# EasyEDA Pro project PicoMiteVGAV1.0.eprj, board PCB3
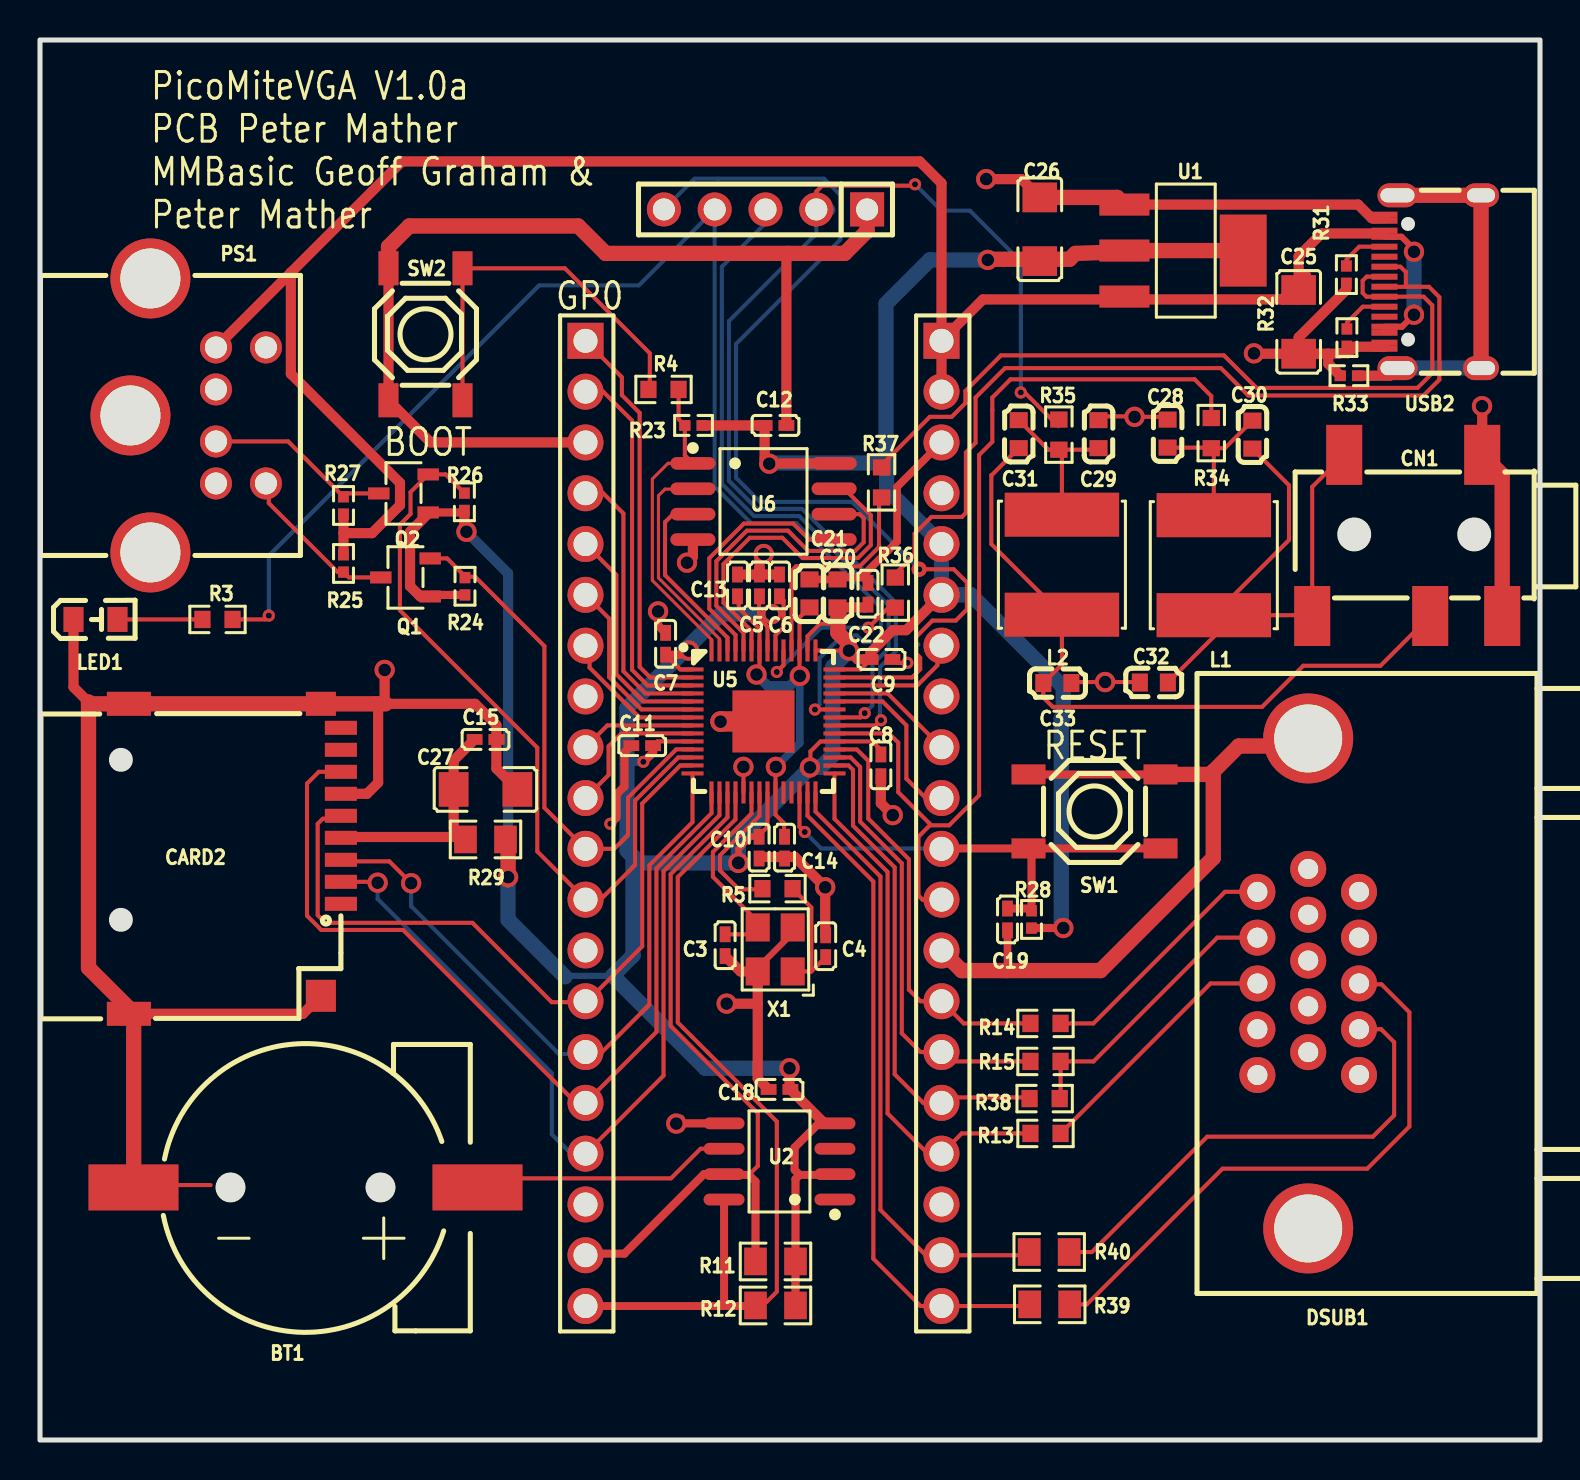
[diagram p1: board, top side]
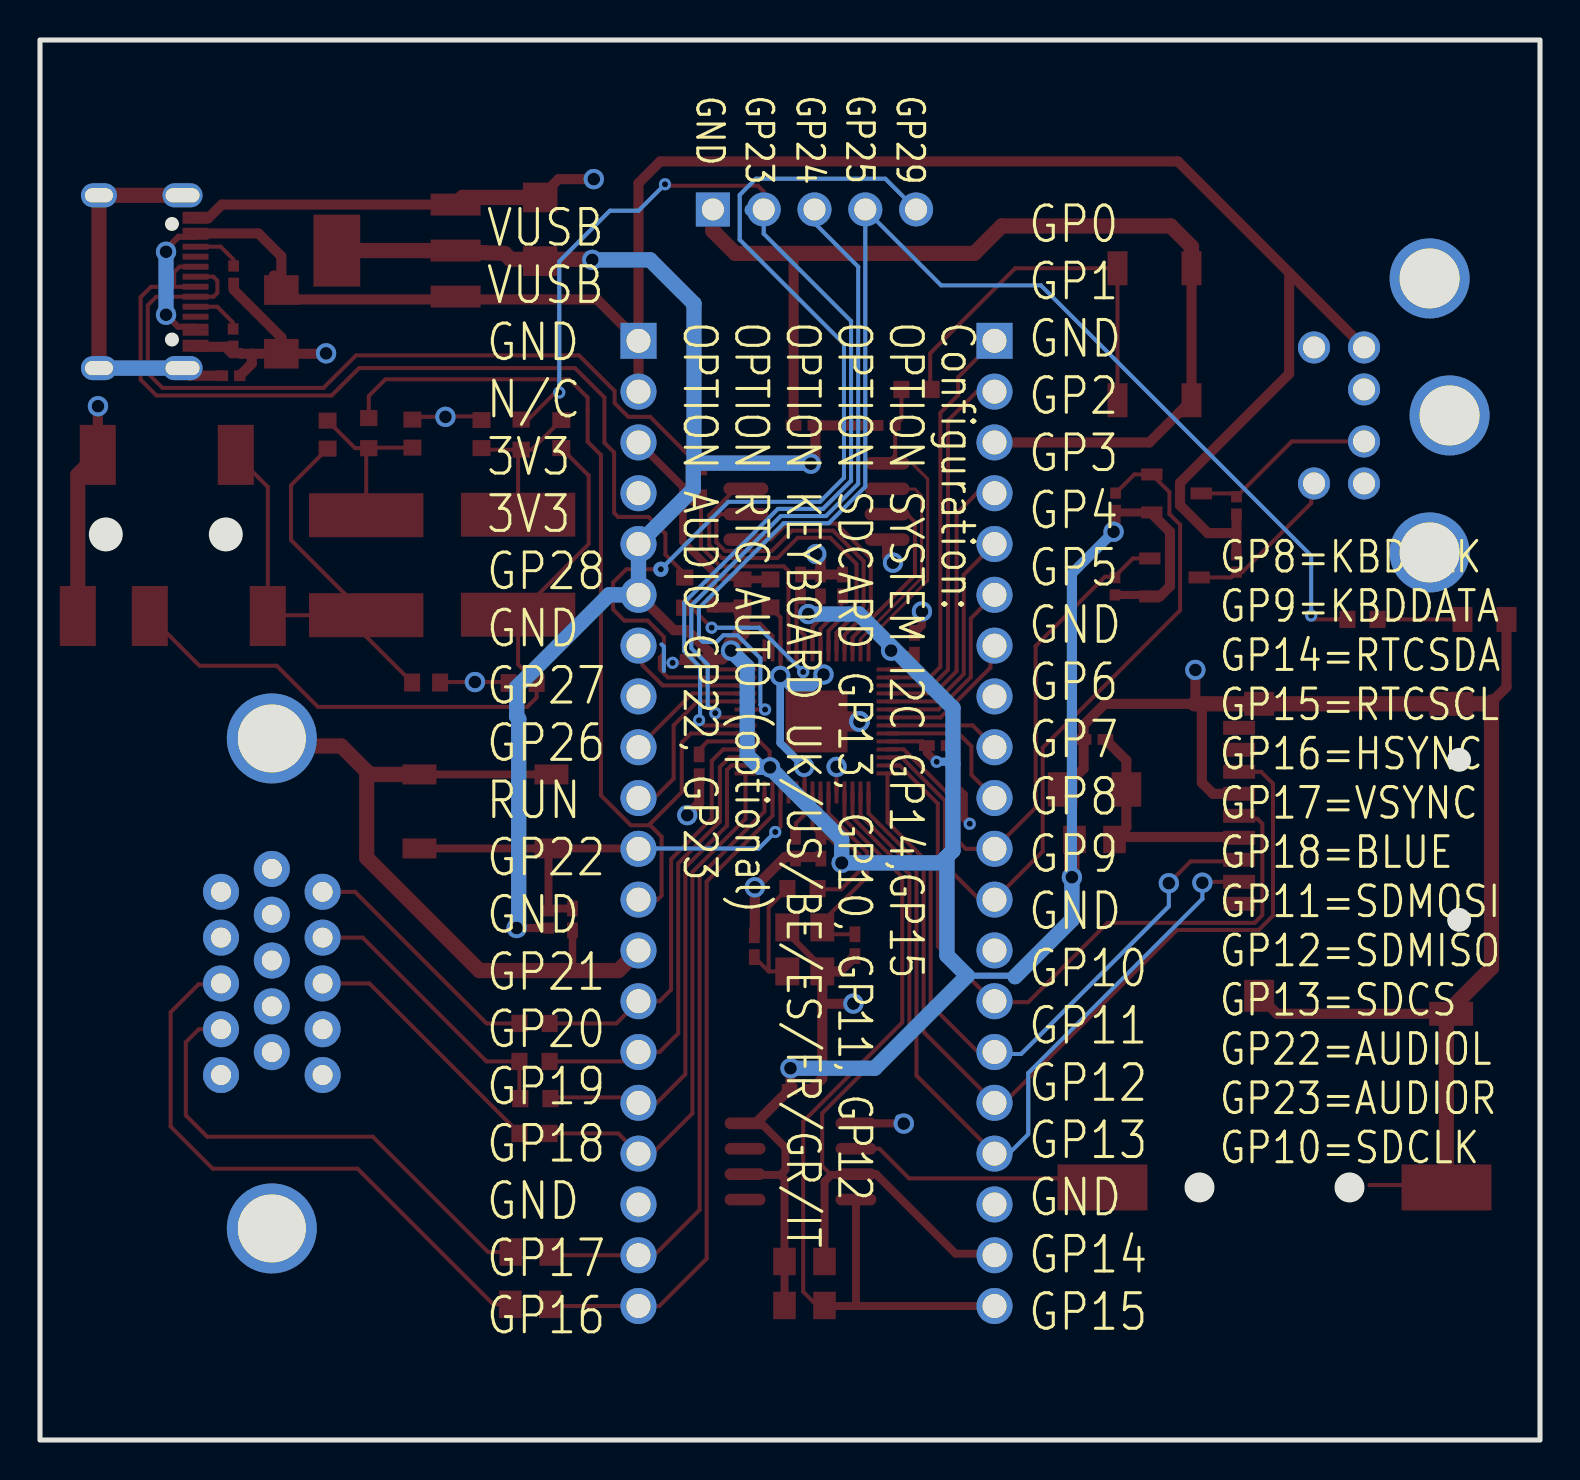
[diagram p2: board, bottom side, seen from below]

Outline 75 x 70 mm; copper layers: Top Layer, Bottom Layer. Coordinates in mm from the lower left corner of the outline.
Outline path: rectangle 75,0 0,70
Stack: Top Layer 0.035mm / Dielectric1 1.51mm FR4 er 4.5 / Bottom Layer 0.035mm

## Design rules (mm)
spacing safeClearance (default): track to track 0.152, other pairs 0.152 to 0.3
track width trackWidth (default): min 0.127, default 0.254, max 2.54
differential pair differentialPair (default): width min 0.127, default 0.254, max 2.54; gap min 0.152, default 0.152
via viaSize (default): diameter min 0.5, default 0.61, max 10; hole min 0.3, default 0.305, max 6

## Placement (name value [footprint] x y rotation side)
BT1  CR1220-2ZX  [BAT-SMD_CR1220-2ZX]  13.27 12.63 180 top
C3  30pF  [C0402]  34.26 24.74 90 top
C4  30pF  [C0402]  39.28 24.69 270 top
C5  100nF  [C0402_NEW]  35.97 42.73 270 top
C6  100nF  [C0402_NEW]  36.97 42.73 270 top
C7  100nF  [C0402_NEW]  31.28 39.81 270 top
C8  100nF  [C0402_NEW]  42.04 33.73 90 top
C9  100nF  [C0402_NEW]  42.07 39.03 180 top
C10  100nF  [C0402_NEW]  35.96 29.62 90 top
C11  100nF  [C0402_NEW]  30.11 34.72 0 top
C12  100nF  [C0402_NEW]  36.78 50.73 180 top
C13  100nF  [C0402_NEW]  34.88 42.73 90 top
C14  100nF  [C0402_NEW]  37.23 29.62 270 top
C15  100nF  [C0402_NEW]  22.28 35.03 0 top
C18  100nF  [C0402_NEW]  36.97 17.53 0 top
C19  100nF  [C0402_NEW]  48.38 26.03 90 top
C20  2.2uF  [C0603]  39.88 42.33 270 top
C21  2.2uF  [C0603]  38.47 42.33 90 top
C22  100nF  [C0402_NEW]  41.4 42.31 270 top
C25  10uF  [C1206]  62.93 55.91 90 top
C26  10uF  [C1206]  49.99 60.54 270 top
C27  10uF  [C1206]  22.28 32.53 0 top
C28  33nF  [C0603]  56.38 50.32 270 top
C29  33nF  [C0603]  52.92 50.29 270 top
C30  2.7nF  [C0603]  60.62 50.27 270 top
C31  2.7nF  [C0603]  48.94 50.29 270 top
C32  68nF  [C0603]  55.69 37.87 0 top
C33  68nF  [C0603]  50.87 37.85 180 top
CARD2  TF PUSH  [TF-SMD_TF-PUSH]  9.74 29.06 270 top
CN1  PJ-327A0-SMT  [AUDIO-SMD_PJ-327A0-SMT]  68.36 45.23 180 top
DSUB1  D-DMRH15PF-E006  [DSUB-TH_15P-P2.29-H-F_DDMRH15PFE006]  63.41 22.83 90 top
H1  PZ254V-11-05P  [HDR-TH_5P-P2.54-V-M]  36.28 61.53 180 top
J1  2.54-1*20P直针  [HDR-TH_20P-P2.54-V-M-1]  27.28 30.83 270 top
J2  2.54-1*20P直针  [HDR-TH_20P-P2.54-V-M-1]  45.07 30.83 270 top
L1  4.7mH  [IND-SMD_L6.0-W6.0]  58.69 43.74 270 top
L2  4.7mH  [IND-SMD_L6.0-W6.0]  51.1 43.77 270 top
LED1  NCD0805R1  [LED0805-RD]  2.77 41.03 0 top
PS1  DS1093-01-PN60  [CONN-TH_DS1093-01-PN60]  7.91 51.23 270 top
Q1  BSN20  [SOT-23-3_L2.9-W1.6-P1.90-LS2.8-BR]  18.28 43.13 0 top
Q2  BSN20  [SOT-23-3_L2.9-W1.6-P1.90-LS2.8-BR]  18.18 47.33 0 top
R3  1kΩ  [R0603]  8.88 41.03 180 top
R4  1kΩ  [R0603]  31.18 52.53 180 top
R5  1kΩ  [R0603]  36.88 27.57 180 top
R11  10kΩ  [R0805]  36.78 8.93 0 top
R12  10kΩ  [R0805]  36.78 6.73 0 top
R13  270Ω  [R0603]  50.28 15.33 0 top
R14  270Ω  [R0603]  50.28 20.83 0 top
R15  390Ω  [R0603]  50.28 18.93 0 top
R23  10kΩ  [R0402]  32.68 50.73 0 top
R24  10kΩ  [R0402]  21.25 42.69 270 top
R25  10kΩ  [R0402]  15.17 43.83 90 top
R26  10kΩ  [R0402]  21.22 46.91 270 top
R27  10kΩ  [R0402]  15.17 46.73 270 top
R28  10kΩ  [R0402]  49.57 26.03 270 top
R29  2.2Ω  [R0805]  22.28 30.03 180 top
R31  5.1kΩ  [R0402]  65.32 58.27 90 top
R32  5.1kΩ  [R0402]  65.34 55.12 90 top
R33  1MΩ  [R0402]  65.45 53.21 0 top
R34  220Ω  [R0603]  58.56 50.34 270 top
R35  220Ω  [R0603]  50.94 50.27 270 top
R36  27Ω  [R0603]  42.76 42.37 90 top
R37  27Ω  [R0603]  42.08 47.88 90 top
R38  820Ω  [R0603]  50.23 17.07 0 top
R39  47Ω  [R0805]  50.49 6.78 0 top
R40  47Ω  [R0805]  50.46 9.4 0 top
SW1  TS-1187A-B-A-B  [SW-SMD_4P-L5.1-W5.1-P3.70-LS6.5-TL-2]  52.73 31.43 180 top
SW2  TS-1187A-B-A-B  [SW-SMD_4P-L5.1-W5.1-P3.70-LS6.5-TL-2]  19.28 55.29 270 top
U1  AMS1117-3.3  [SOT-223-3_L6.5-W3.4-P2.30-LS7.0-BR]  57.19 59.47 180 top
U2  DS3231MZ+TRL  [SOIC-8_L4.9-W3.9-P1.27-LS6.0-BL]  36.97 13.93 90 top
U5  RP2040  [LQFN-56_L7.0-W7.0-P0.4-EP]  36.18 35.93 0 top
U6  W25Q128JVSIQ  [SOIC-8_L5.3-W5.3-P1.27-LS8.0-BL]  36.18 46.93 270 top
USB2  KH-TYPE-C-16P  [USB-C-SMD_KH-TYPE-C-16P]  69.64 57.91 90 top
X1  12MHz  [OSC-SMD_4P-L3.2-W2.5-BL]  36.76 24.53 90 top

## Footprints (pads in the part's own frame, mm; a bottom-side part is the same pattern mirrored in y, then rotated)
AUDIO-SMD_PJ-327A0-SMT
  rect 1.8x3 smd: 2(3.15,-4.028) 3(-3.75,-4.028) 4(-4.75,4.028) 5(-1.15,4.028) 6(4.75,4.028)
BAT-SMD_CR1220-2ZX
  rect 4.5x2.3 smd: 1(-8.6,0) 2(8.6,0)
C0402
  rect 0.79x0.54 smd: 1(-0.545,0) 2(0.545,0)
C0402_NEW
  rect 0.79x0.54 smd: 1(-0.545,0) 2(0.545,0)
C0603
  rect 0.8x0.9 smd: 1(-0.7,0) 2(0.7,0)
C1206
  rect 1.485x1.728 smd: 1(-1.593,0) 2(1.593,0)
CONN-TH_DS1093-01-PN60
  round 1.6 hole 1.1: 1(1.3,0.888) 2(-1.3,0.888) 3(3.4,0.888) 4(-3.4,0.888) 5(3.4,3.388) 6(-3.4,3.388)
  round 4 hole 3: 7(0,-3.388) 8(-6.85,-2.39) 9(6.85,-2.39)
DSUB-TH_15P-P2.29-H-F_DDMRH15PFE006
  round 1.8 hole 1: 1(4.58,2.54) 2(2.29,2.54) 3(0,2.54) 4(-2.29,2.54) 5(-4.58,2.54) 6(5.725,0) 7(3.435,0) 8(1.145,0) 9(-1.145,0) 10(-3.435,0) 11(4.58,-2.54) 12(2.29,-2.54) 13(0,-2.54) 14(-2.29,-2.54) 15(-4.58,-2.54)
  round 4.5 hole 3.4: 16(-12.25,0) 17(12.25,0)
HDR-TH_5P-P2.54-V-M
  rect 1.7x1.7 hole 1.1: 1(-5.08,0)
  round 1.7 hole 1.1: 2(-2.54,0) 3(0,0) 4(2.54,0) 5(5.08,0)
HDR-TH_20P-P2.54-V-M-1
  rect 1.8x1.8 hole 1.2: 1(-24.13,0)
  round 1.8 hole 1.2: 2(-21.59,0) 3(-19.05,0) 4(-16.51,0) 5(-13.97,0) 6(-11.43,0) 7(-8.89,0) 8(-6.35,0) 9(-3.81,0) 10(-1.27,0) 11(1.27,0) 12(3.81,0) 13(6.35,0) 14(8.89,0) 15(11.43,0) 16(13.97,0) 17(16.51,0) 18(19.05,0) 19(21.59,0) 20(24.13,0)
IND-SMD_L6.0-W6.0
  rect 2.2x5.72 smd: 1(-2.5,0) 2(2.5,0)
LED0805-RD
  rect 1x1.25 smd: 1(-1.1,0) 2(1.1,0)
LQFN-56_L7.0-W7.0-P0.4-EP
  rect 1.1x0.2 smd: 1(-3.55,2.6) 2(-3.55,2.2) 3(-3.55,1.8) 4(-3.55,1.4) 5(-3.55,1) 6(-3.55,0.6) 7(-3.55,0.2) 8(-3.55,-0.2) 9(-3.55,-0.6) 10(-3.55,-1) 11(-3.55,-1.4) 12(-3.55,-1.8) 13(-3.55,-2.2) 14(-3.55,-2.6) 29(3.55,-2.6) 30(3.55,-2.2) 31(3.55,-1.8) 32(3.55,-1.4) 33(3.55,-1) 34(3.55,-0.6) 35(3.55,-0.2) 36(3.55,0.2) 37(3.55,0.6) 38(3.55,1) 39(3.55,1.4) 40(3.55,1.8) 41(3.55,2.2) 42(3.55,2.6)
  rect 0.2x1.1 smd: 15(-2.6,-3.55) 16(-2.2,-3.55) 17(-1.8,-3.55) 18(-1.4,-3.55) 19(-1,-3.55) 20(-0.6,-3.55) 21(-0.2,-3.55) 22(0.2,-3.55) 23(0.6,-3.55) 24(1,-3.55) 25(1.4,-3.55) 26(1.8,-3.55) 27(2.2,-3.55) 28(2.6,-3.55) 43(2.6,3.55) 44(2.2,3.55) 45(1.8,3.55) 46(1.4,3.55) 47(1,3.55) 48(0.6,3.55) 49(0.2,3.55) 50(-0.2,3.55) 51(-0.6,3.55) 52(-1,3.55) 53(-1.4,3.55) 54(-1.8,3.55) 55(-2.2,3.55) 56(-2.6,3.55)
  rect 3.1x3.1 smd: 57(0,0)
OSC-SMD_4P-L3.2-W2.5-BL
  rect 1.4x1.2 smd: 1(-1.1,-0.875) 2(1.1,-0.875) 3(1.1,0.875) 4(-1.1,0.875)
R0402
  rect 0.566x0.54 smd: 1(-0.433,0) 2(0.433,0)
R0603
  rect 0.806x0.864 smd: 1(-0.753,0) 2(0.753,0)
R0805
  rect 1.133x1.377 smd: 1(-1,0) 2(1,0)
SOIC-8_L4.9-W3.9-P1.27-LS6.0-BL
  oval 0.588x2.045 smd: 1(-1.905,-2.772) 2(-0.635,-2.772) 3(0.635,-2.772) 4(1.905,-2.772) 5(1.905,2.772) 6(0.635,2.772) 7(-0.635,2.772) 8(-1.905,2.772)
SOIC-8_L5.3-W5.3-P1.27-LS8.0-BL
  oval 0.63x2.25 smd: 1(-1.905,-3.53) 2(-0.635,-3.53) 3(0.635,-3.53) 4(1.905,-3.53) 5(1.905,3.53) 6(0.635,3.53) 7(-0.635,3.53) 8(-1.905,3.53)
SOT-23-3_L2.9-W1.6-P1.90-LS2.8-BR
  rect 1.07x0.6 smd: 1(1.235,-0.95) 2(1.235,0.95) 3(-1.235,0)
SOT-223-3_L6.5-W3.4-P2.30-LS7.0-BR
  rect 2.5x1.1 smd: 1(2.97,-2.3) 2(2.97,0) 3(2.97,2.3)
  rect 2.34x3.6 smd: 4(-2.97,0)
SW-SMD_4P-L5.1-W5.1-P3.70-LS6.5-TL-2
  rect 1.7x1 smd: 1(-3.3,1.85) 2(3.3,1.85) 3(-3.3,-1.85) 4(3.3,-1.85)
TF-SMD_TF-PUSH
  rect 0.7x1.6 smd: 1(2.25,5.3) 2(1.15,5.3) 3(0.05,5.3) 4(-1.05,5.3) 5(-2.15,5.3) 6(-3.25,5.3) 7(-4.35,5.3) 8(-5.45,5.3) CD(-6.55,5.3)
  rect 1.2x1.5 smd: 10(-7.75,4.3)
  rect 1.2x2.2 smd: 11(-7.75,-5.3) 12(7.75,-5.3)
  rect 1.6x1.5 smd: 13(6.85,4.3)
USB-C-SMD_KH-TYPE-C-16P
  oval 1.2x2 hole 0.7x1.7: 1(-4.32,1.765) 2(4.32,1.765)
  oval 1.2x1.8 hole 0.7x1.4: 3(-4.32,-2.415) 4(4.32,-2.415)
  rect 0.3x1.3 smd: A1(-3.35,2.415) A4(-2.55,2.415) A5(-1.25,2.415) A6(-0.25,2.415) A7(0.25,2.415) A8(1.25,2.415) A9(2.55,2.415) A12(3.35,2.415) B1(3.05,2.415) B4(2.25,2.415) B5(1.75,2.415) B6(0.75,2.415) B7(-0.75,2.415) B8(-1.75,2.415) B9(-2.25,2.415) B12(-3.05,2.415)

## Nets
As in the schematic.

Pads without a net: CARD2 1 8 CD; DSUB1 4 9 11 12 15; J2 4; PS1 2 6; U2 1 3; U5 24 25; USB2 A8 B8

## Via types
v1: diameter 1.016, hole 0.635, Top Layer to Bottom Layer, 32 vias
v2: diameter 0.61, hole 0.305, Top Layer to Bottom Layer, 13 vias
v3: diameter 1.016, hole 0.66, Top Layer to Bottom Layer, 1 via
v4: diameter 0.762, hole 0.305, Top Layer to Bottom Layer, 1 via

## Routing (per net, layer and track width the routed paths; a pad name or vN(x,y) marks a point on that pad's centre or on a via; arc(x,y) is an arc through that point)
1V1: length 19.3
  Top Layer w0.203: v1(35.82,38.27) 35.97,38.42 U5.50 35.97,40.56 34.94,41.6 34.94,42.12 C13.1 ; v1(36.8,33.66) 36.78,33.64 U5.23 36.78,31.26 37.2,30.84 37.2,30.26 37.23,30.24 ; v1(37.99,38.2) 37.97,38.22 U5.45 37.97,41.13 C21.1
  Bottom Layer w0.381: v1(36.8,33.66) 37.99,34.85 v1(37.99,38.2)
  Bottom Layer w0.508: v1(35.82,38.27) 36.41,37.69 37.48,37.69 v1(37.99,38.2)
+5V: length 104
  Top Layer w0.203: 67.22,60.46 67.22,60.16 ; 63.31,58.23 63.11,58.03 ; USB2.B9 USB2.A4
  Top Layer w0.305: v1(68.7,59.41) 68.7,59.54 68.07,60.16 67.22,60.16 ; v1(68.7,56.26) 68.1,55.66 USB2.B9
  Top Layer w0.508: 62.93,57.85 62.12,57.03 47.15,57.03 J2.1 ; 62.93,57.85 C25.2 ; 62.93,57.85 63.31,58.23 ; 62.93,57.85 62.93,59.18 64.07,60.33 67.2,60.33 67.22,60.3 ; 15.17,46.3 15.17,45.34 ; 15.17,45.34 15.17,44.26 ; 15.17,45.34 16.6,45.34 18,46.74 18,47.86 12.54,53.31 12.54,58.37 ; PS1.4 12.54,58.37 ; 12.54,58.37 18.1,63.93 43.99,63.93 45.07,62.84 J2.1 ; J2.1 J2.2
  Bottom Layer w0.762: v1(68.7,56.26) v1(68.7,59.41)
GND: length 268.3
  Top Layer w0.203: C28.1 56.24,51.16 v1(54.73,51.16) 54.7,51.18 53.19,51.18 ; USB2.B1 USB2.A12 ; USB2.B12 USB2.A1 ; C32.1 54.97,37.9 v1(53.25,37.9) 51.62,37.9 51.57,37.85 ; C9.1 42.79,38.86 v2(43.37,38.86) ; U5.19 35.18,33.65 v1(35.17,33.66) ; 4.79,12.75 8.53,12.75
  Top Layer w0.305: X1.2 37.64,25.35 35.89,23.6 X1.4
  Top Layer w0.381: 48.36,23.47 48.38,23.48 C19.1 ; J2.3 42.85,47.66 42.85,44.92 41.06,43.13 39.97,43.13 C20.1 C21.2
  Top Layer w0.399: SW1.3 SW1.4
  Top Layer w0.406: U2.5 31.82,15.83 v1(31.81,15.82) ; C11.1 29.22,34.37 29.22,32.68 28.81,32.27 28.81,31.11 v2(28.51,30.81) ; v1(30.9,41.43) 30.9,40.73 31.28,40.36
  Top Layer w0.508: v1(72.1,51.69) 72.11,51.68 CN1.3 ; 64.41,54.31 64.94,54.31 64.96,54.34 65.4,54.34 65.73,54.66 67.21,54.66 67.22,54.67 ; 64.41,54.31 C25.1 ; 64.41,54.31 64.41,53.82 R33.1 ; U1.1 65.91,61.77 66.59,61.09 67.22,61.09 ; J1.3 19.53,49.88 17.42,51.99 17.42,58.59 ; v1(42.64,31.24) 42.04,31.84 C8.1 ; C25.1 62.93,55.13 65.32,57.52 ; C25.1 60.71,54.31 v1(60.7,54.33) ; C12.1 37.32,59.25 37.4,59.33 ; C5.1 35.97,44.01 36.21,44.24 ; C5.1 C6.1 ; C5.1 C13.2 ; 16.82,36.81 16.91,36.72 16.91,32.87 16.35,32.31 CARD2.6 ; C26.1 49.07,63.04 v1(47.31,63.04) ; C3.1 35.02,23.43 X1.4 35.89,21.81 ; CARD2.12 13.14,21.31 CARD2.13 ; C18.1 35.89,18.07 35.89,21.81 ; 35.96,29.15 37.75,29.15 v1(39.26,27.64) 39.26,25.17 ; 2.42,36.9 1.67,37.65 LED1.1 ; C27.2 22.82,33.58 C15.2 22.82,35.75 21.76,36.81 17.27,36.81 17.23,36.85 v1(17.23,38.5) ; 35.89,21.81 34.34,21.81 v1(34.33,21.82) ; U6.4 32.65,44.16 v1(32.35,43.87)
  Top Layer w0.762: C26.1 53.86,62.13 U1.1 ; 58.66,33.43 58.51,33.28 SW1.3 ; 58.66,33.43 59.94,34.7 63.03,34.7 DSUB1.17 ; 58.66,33.43 58.66,29.11 53.03,23.47 46.08,23.47 J2.13 ; CN1.4 73.11,48.26 CN1.3 ; 17.42,58.59 17.42,59.66 18.46,60.7 26.91,60.7 28.28,59.33 40.24,59.33 41.35,60.45 H1.1 ; 4.79,12.75 4.68,12.86 4.68,21.35 2.42,23.61 2.42,36.9 2.52,36.81 CARD2.11 CARD2.10 17.27,36.81
  Top Layer w1.016: v1(34.03,35.92) 34.04,35.93 U5.57
  Bottom Layer w0.203: 43.92,39.78 43.81,39.67 43.81,38.46
  Bottom Layer w0.406: 32.04,16.07 32.04,16.05 v1(31.81,15.82)
  Bottom Layer w1.016: v1(34.03,35.92) 34.03,35.94
  vias: v1(36.19,44.3)
VCC: length 218.9
  Top Layer w0.203: U5.49 36.38,40.66 35.95,41.09 35.95,42.16 C5.2 ; U5.1 32.01,38.53 C7.2 ; 39.89,41.61 C20.2 ; C9.2 41.03,38.53 39.72,38.53 ; 40.44,39.47 39.03,39.47 39.03,39.48 U5.43 ; 38.52,33.63 38.52,34.43 39.02,34.93 41.62,34.93 42.18,34.37 ; 35.95,41.3 v1(36.59,41.3) 37.17,41.3 37.18,41.29 ; 39.89,41.07 39.63,40.81 39,40.81 38.38,40.19 U5.44 ; 37.18,41.29 37.18,41.98 C6.2 ; 37.18,41.29 37.18,40.64 36.78,40.24 U5.48 ; 30.66,34.72 30.87,34.93 U5.10 ; U5.22 36.38,30.66 35.96,30.24
  Top Layer w0.305: C10.2 35.54,30.16 34.92,29.54 v3(34.92,28.86)
  Top Layer w0.399: 39.22,15.83 38.94,15.83 37.73,14.63 37.73,13.51 37.98,13.25 ; 37.98,13.25 37.78,13.05 R11.2 R12.2 ; 37.98,13.25 39.71,13.25 U2.2
  Top Layer w0.406: R26.2 21.12,46.38 Q2.1 ; v1(51.17,25.6) 49.58,25.6 R28.2 ; v1(32.45,39.47) 32.19,39.47 31.99,39.26 C7.2 ; R24.2 19.59,42.25 Q1.1 ; v2(30.17,33.91) 30.19,33.91 30.66,34.37 30.66,34.72
  Top Layer w0.508: 39.7,48.83 36.48,48.83 v1(36.46,48.81) 36.23,49.05 C12.2 R23.2 ; R26.2 21.22,45.51 v1(21.32,45.41) ; v1(40.45,39.47) 40.89,39.03 C9.2 41.53,39.38 42.64,40.49 43.31,40.49 J2.6 ; U2.4 39.22,15.83 C18.2 37.48,17.57 v1(37.48,18.59) ; C22.2 41.26,41.63 C20.2 ; Q1.1 19.01,42.18 18.5,42.69 18.5,45.41 19.41,46.32 Q2.1
  Top Layer w0.762: 55.7,59.47 U1.2 ; 55.7,59.47 U1.4 ; 55.7,59.47 51.77,59.33 51.47,59.04 47.42,59.04 v1(47.39,59.01) ; v1(40.45,39.47) 40.45,39.81 39.89,40.36 39.89,41.61 ; v1(23.4,28.14) 23.4,29.9 R29.1
  Bottom Layer w0.305: 28.64,23.21 26.3,23.21 26.25,23.16
  Bottom Layer w0.406: v2(30.17,33.91) 29.48,33.91 29.35,33.78
  Bottom Layer w0.508: v1(21.32,45.41) 23.4,43.33 v1(23.4,28.14) ; v1(32.45,39.47) 32.38,39.47 32.3,39.55
  Bottom Layer w0.762: 29.65,29.17 29.97,28.86 v3(34.92,28.86) 34.92,30.02 38.52,33.63 39.03,33.63 39.64,34.24 39.64,38.66 v1(40.45,39.47) ; 29.65,29.17 29.35,29.47 29.35,36.6 34.05,41.3 v1(36.59,41.3) ; 29.65,29.17 29.65,24.23 28.64,23.21 33.26,18.59 v1(37.48,18.59) ; v1(23.4,28.14) 23.4,26.01 26.25,23.16 ; v1(36.46,48.81) 36.49,48.84 42.3,48.84 ; 42.3,48.84 42.33,48.81 42.33,47.54 J2.5 J2.6 46.55,42.26 51.17,37.64 51.17,36.17 51.06,36.06 51.06,25.7 v1(51.17,25.6) ; 42.3,48.84 42.3,56.82 44.49,59.01 v1(47.39,59.01)
  vias: v1(38.5,33.63)
GP0: length 20.3
  Top Layer w0.203: J1.1 29.09,53.14 29.09,52.24 29.98,51.36 29.98,38.66 30.51,38.13 U5.2
GP1: length 18.7
  Top Layer w0.203: J1.2 28.16,52.42 29.6,50.97 29.6,38.51 30.38,37.73 U5.3
GP2: length 14.1
  Top Layer w0.203: J1.4 28.16,47.34 29.17,46.33 29.17,38.44 30.28,37.33 U5.4
GP3: length 11.5
  Top Layer w0.203: J1.5 28.81,43.26 28.81,38.29 30.18,36.93 U5.5
GP4: length 9.4
  Top Layer w0.203: J1.6 28.46,41.07 28.46,38.14 30.07,36.53 U5.6
GP5: length 7.4
  Top Layer w0.203: U5.7 29.97,36.13 27.48,38.62 27.48,39.52 J1.7
GP6: length 5.8
  Top Layer w0.203: U5.8 28.37,35.73 J1.9
GP7: length 7.5
  Top Layer w0.203: U5.9 29.07,35.33 28.43,34.69 28.43,33.25 J1.10
GP8: length 27
  Top Layer w0.203: U5.11 32.62,34.53 31.82,34.53 29.4,32.12 29.4,30.25 28.71,29.56 J1.11 25.22,31.61 25.22,39.69 21.75,43.16 21.28,43.16 20.36,44.08 Q1.2
GP9: length 38.1
  Top Layer w0.203: R26.1 20.28,48.28 Q2.2 18.53,47.4 18.53,46.3 17.99,45.77 17.99,41.48 24.86,34.61 24.86,29.43 J1.12 28.02,27.02 29.75,28.75 29.75,31.97 31.91,34.13 U5.12
GP10: length 35.5
  Top Layer w0.203: U5.13 32.02,33.73 30.11,31.82 30.11,24.69 27.36,21.94 J1.14 27.23,21.89 25.59,21.89 21.62,25.86 14.27,25.86 13.88,26.24 13.88,30.81 14.14,31.07 14.9,31.07 CARD2.5
GP11: length 33.6
  Top Layer w0.203: CARD2.3 15.12,28.93 17.47,28.93 v1(18.56,27.84) ; J1.15 28.1,19.4 30.47,21.76 30.47,28.73 32.62,30.89 U5.14
  Bottom Layer w0.203: J1.15 27.18,19.3 25.94,19.3 18.56,26.69 v1(18.56,27.84)
GP12: length 44.5
  Top Layer w0.203: CARD2.7 13.94,33.41 13.35,32.82 13.35,26.21 14.06,25.5 18.15,25.5 26.8,16.86 J1.16 30.82,20.4 30.82,28.58 33.57,31.34 U5.15
GP13: length 41
  Top Layer w0.203: CARD2.2 16.84,27.91 v1(16.88,27.86) ; U5.16 33.97,31.23 31.18,28.44 31.18,18.22 J1.17
  Bottom Layer w0.203: v1(16.88,27.86) 16.88,27.05 25.59,18.35 25.59,15.29 26.56,14.32 J1.17
GP14: length 36.6
  Top Layer w0.203: U5.17 34.38,31.13 31.53,28.29 31.53,20.7 35.89,16.34 35.89,13.7 35.44,13.25
  Top Layer w0.399: J1.19 27.35,9.32 29.22,9.32 33.2,13.29 U2.7 34.24,13.25 35.44,13.25 35.78,12.92 R11.1
GP15: length 43.5
  Top Layer w0.203: R12.1 35.95,6.91 36.33,6.91 36.84,7.41 36.84,15.92 31.89,20.88 31.89,28.14 34.78,31.03 U5.18
  Top Layer w0.399: 34.07,6.7 34.2,6.83 U2.8 ; 34.07,6.7 J1.20 ; 34.07,6.7 35.75,6.7 R12.1
GP16: length 33.5
  Top Layer w0.203: R39.1 49.4,6.7 J2.20 44.03,6.7 41.67,9.06 41.67,27.92 38.38,31.21 U5.27
GP17: length 30.7
  Top Layer w0.203: R40.1 49.3,9.24 J2.19 44.29,9.24 42.02,11.5 42.02,28.17 38.78,31.42 U5.28
GP18: length 26.5
  Top Layer w0.203: 39.72,33.33 39.72,31.06 42.38,28.4 42.38,16.33 44.39,14.32 J2.17 46.09,15.33 R13.1
GP19: length 24.6
  Top Layer w0.203: 49.52,17.13 45.34,17.13 J2.16 44.16,16.86 42.73,18.28 42.73,28.63 40.65,30.72 40.65,33.5 40.43,33.73 39.72,33.73
GP20: length 22.7
  Top Layer w0.203: R15.1 45.54,18.93 J2.15 44.02,19.4 43.09,20.33 43.09,28.84 41.01,30.92 41.01,33.65 40.53,34.13 39.72,34.13
GP21: length 21
  Top Layer w0.203: R14.1 46.19,20.83 J2.14 44.02,21.94 43.44,22.52 43.44,29.04 41.41,31.07 41.41,33.96 40.84,34.53 39.72,34.53
GP22: length 49.2
  Top Layer w0.203: 44.49,30.74 44.49,30.81 42.91,32.39 42.91,34.87 42.45,35.33 39.72,35.33 ; 44.49,30.74 43.92,30.17 43.92,27.22 44.12,27.02 J2.12 ; 44.49,30.74 45.46,30.74 46.96,32.23 46.96,49.25 47.62,49.91 47.62,51.51 ; R34.1 58.56,52.2 57.72,53.04 48.53,53.04 47.62,52.12 47.62,51.51 ; 47.62,51.51 47.61,51.5
GP23: length 57.7
  Top Layer w0.203: 39.72,35.73 41.79,35.73 v2(42.05,35.99) ; v2(43.75,62.78) 43.68,62.71 39.11,62.71 38.81,62.42 H1.2 ; v2(49.04,52.38) 49.23,52.38 50.92,50.69
  Bottom Layer w0.203: v2(43.75,62.78) 45.07,61.46 46.5,61.46 49.04,58.93 v2(49.04,52.38) ; v2(42.05,35.99) 42,36.04 42,38.65 42.79,39.44 42.79,41.87 38.1,46.55 35.85,46.55 34.45,47.96 34.45,55.94 38.81,60.31 H1.2
  Bottom Layer w0.508: 39.51,61.46 39.51,61.53 H1.2
GP24: length 33
  Top Layer w0.203: 39.72,36.13 41.02,36.13 v2(41.24,36.34)
  Bottom Layer w0.203: H1.3 36.28,60.85 34.09,58.66 34.09,47.81 35.7,46.2 37.96,46.2 42.43,41.72 42.43,39.59 41.62,38.77 41.62,36.72 v2(41.24,36.34)
GP25: length 68
  Top Layer w0.203: R3.1 11.25,41.03 v2(11.44,41.22) ; v2(38.75,36.52) 38.75,36.53 39.72,36.53
  Bottom Layer w0.203: v2(11.44,41.22) 11.44,44.22 24.95,57.73 29.94,57.73 H1.4 33.73,47.66 35.56,45.84 37.81,45.84 42.05,41.6 42.05,40.1 41.85,39.9 41.17,39.9 40.83,40.23 40.12,40.23 38.98,39.09 38.98,36.75 v2(38.75,36.52)
GP26: length 8.9
  Top Layer w0.203: J2.10 44.29,32.1 43.32,33.07 43.32,35.73 42.12,36.93 39.72,36.93
GP27: length 6.5
  Top Layer w0.203: 39.72,37.33 42.38,37.33 J2.9
GP28: length 6.6
  Top Layer w0.203: J2.7 44.87,39.52 44.87,38.74 43.86,37.73 39.72,37.73
GP29: length 50.5
  Top Layer w0.203: v4(43.96,43.54) 45.69,43.54 46.35,42.88 46.35,41.53 45.79,40.97 44.62,40.97 43.81,40.16 43.81,39.32 44.01,39.12 44.01,38.53 43.6,38.13 39.72,38.13
  Bottom Layer w0.203: H1.5 32.73,63.06 33.89,63.06 ; v4(43.96,43.54) 40.59,46.91 36,46.91 34.8,48.11 34.8,54.8 40.02,60.02 40.02,62.25 39.2,63.06 33.89,63.06 ; 33.89,63.06 33.92,63.04
HSYNC: length 29.5
  Top Layer w0.203: DSUB1.13 65.99,22.78 67.07,22.78 68.47,21.39 68.47,15.67 66.36,13.56 59.12,13.56 52.34,6.78 R39.2
RUN: length 24.8
  Top Layer w0.203: U5.26 37.97,30.66 v2(38.24,30.4)
  Top Layer w0.399: SW1.1 50,29.58 ; 50,29.58 49.57,29.15 49.57,26.46 49.46,26.57 48.38,26.57 ; 50,29.58 SW1.2 v2(45.09,29.58) J2.11
  Bottom Layer w0.203: v2(38.24,30.4) 39.06,29.58 v2(45.09,29.58)
SD-VCC: length 11.8
  Top Layer w0.508: CARD2.4 15.09,30.15 21.15,30.15 ; 21.15,30.15 20.68,30.62 C27.1 20.68,33.98 C15.1 ; 21.15,30.15 R29.2
USB-DM: length 40
  Top Layer w0.203: 42.1,48.76 44.49,51.16 45.58,51.16 46.27,51.84 46.27,52.45 48.05,54.23 59.2,54.23 60.82,52.61 68.88,52.61 69.61,53.34 69.61,56.73 69.18,57.16 USB2.B7 66.32,57.16 66.13,57.35 66.13,57.96 66.34,58.17 67.22,58.17 USB2.A7
USB-DP: length 45.6
  Top Layer w0.203: 68.29,57.66 68.29,58.39 68.02,58.66 USB2.B6 ; 68.29,57.66 66.88,57.66 ; 68.29,57.66 69.45,57.66 69.97,57.14 69.97,53.02 69.18,52.22 60.42,52.22 59.05,53.6 48.25,53.6 46.78,52.12 46.78,49.86 46.29,49.38 46.29,46.36 46.09,46.15 44.57,46.15 43.73,45.31 43.73,44.27 42.76,43.31 R36.2
VSYNC: length 24.8
  Top Layer w0.203: R40.2 52.59,9.4 58.36,15.17 66.64,15.17 67.71,16.23 67.71,19.89 67.06,20.54 DSUB1.14
$1N15506: length 11.4
  Top Layer w0.203: U5.46 37.57,43.45 37.8,43.68 40.98,43.68 41.95,44.65 41.95,47 R37.1
$1N15528: length 8.5
  Top Layer w0.203: v2(41.42,40.62) 42.48,41.67 42.78,41.67 ; U5.47 37.18,38.73 v2(36.84,38.4)
  Bottom Layer w0.203: v2(41.42,40.62) 39.06,40.62 v2(36.84,38.4)
$1N16226: length 14.2
  Top Layer w0.203: DSUB1.2 58.86,25.12 52.67,18.93 R15.2 51.03,17.13
$1N16303: length 12.9
  Top Layer w0.203: DSUB1.3 58.53,22.83 R13.2
$1N16324: length 12.6
  Top Layer w0.203: R14.2 52.67,20.83 59.25,27.41 DSUB1.1
$1N17160: length 16.4
  Top Layer w0.203: U5.52 35.18,40.36 33.82,41.71 33.82,43.94 35.34,45.47 37.39,45.47 38.41,44.45 40.75,44.45 41.18,44.89 41.18,46.09 40.98,46.29 39.7,46.29
$1N17190: length 17.4
  Top Layer w0.203: 39.7,47.56 39.72,47.55 40.23,47.55 41.54,46.24 41.54,44.74 40.9,44.1 38.13,44.1 37.12,45.11 35.49,45.11 34.17,43.8 34.17,41.86 35.57,40.46 U5.51
$1N17220: length 9.3
  Top Layer w0.203: U6.3 31.65,46.29 31.25,45.89 31.25,43.24 34.38,40.12 U5.54
$1N17286: length 10.9
  Top Layer w0.152: U6.2 32.63,47.55 31.25,47.55 30.92,47.22 30.92,43.1 33.97,40.05 U5.55
$1N17350: length 16.1
  Top Layer w0.152: U5.56 33.57,40.02 30.62,42.98 30.62,48.05 31.4,48.83 U6.1
  Top Layer w0.203: U6.1 32.24,49.24 R23.1 31.93,51.04 R4.1
$1N17556: length 12.4
  Top Layer w0.203: U5.53 34.78,40.25 33.46,41.56 33.46,44.09 35.2,45.82 37.66,45.82 38.46,45.02 39.7,45.02
$1N17761: length 7.2
  Top Layer w0.203: U5.21 35.97,31.21 34,29.24 34,28.47 34.94,27.53 36.09,27.53 R5.2
$1N17798: length 6.5
  Top Layer w0.203: X1.1 38.57,23.43 ; 38.57,23.43 C4.2 ; 38.57,23.43 38.57,26.63 R5.1
$1N18648: length 10.3
  Top Layer w0.203: C3.2 35.54,25.29 X1.3 35.89,25.92 33.65,28.16 33.65,29.4 35.57,31.33 U5.20
$1N19413: length 19.6
  Top Layer w0.203: R4.2 30.49,52.6 30.49,54.34 26.24,58.59 SW2.1 SW2.2
$1N20967: length 9.4
  Top Layer w0.203: PS1.1 12.41,49.93 R27.1 15.34,47.33 Q2.3
$1N21008: length 8.2
  Top Layer w0.203: Q1.3 15.44,43.13 R25.1 14.89,43.39 11.44,46.84 11.44,47.69 PS1.5
$1N25166: length 4.2
  Top Layer w0.203: 3.88,41.03 R3.2
$1N34038: length 13.1
  Top Layer w0.203: U2.6 33.03,14.56 31.55,13.08 23.38,13.08 22.93,12.63 BT1.1
$1N89274: length 2.2
  Top Layer w0.203: USB2.B5 65.96,59.66 65.32,59.02
$1N89558: length 2.2
  Top Layer w0.203: 65.34,55.87 66.14,56.66 USB2.A5
$1N90266: length 19.1
  Top Layer w0.508: USB2.1 67.49,53.21 R33.2
  Top Layer w0.762: USB2.3 USB2.4 USB2.2
  Bottom Layer w0.762: USB2.1 USB2.3
$1N123261: length 8.2
  Top Layer w0.203: C28.2 58.54,49.62 58.56,49.59 ; 58.56,49.59 58.69,49.46 L1.1 ; 58.56,49.59 59.24,49.59 C30.1
$1N123370: length 7.8
  Top Layer w0.203: 51.1,46.42 51.1,49.36 R35.2 ; R35.2 50.42,49.51 C31.1 ; R35.2 52.85,49.51 C29.2
$1N128203: length 28.6
  Top Layer w0.203: C32.2 58.69,40.17 L1.2 ; L1.2 63.57,41.24 CN1.6 63.61,47.66 CN1.2 ; L1.2 62.45,45 62.45,47.74 C30.2
$1N128821: length 36.3
  Top Layer w0.203: CN1.5 67.02,38.71 63.16,38.71 61.1,36.65 50.64,36.65 50.17,37.12 C33.2 51.1,38.78 L2.2 47.56,44.8 47.56,48.24 47.58,48.24 C31.2

## Copper pours and planes (outline as drawn; the poured copper is in the pictures)
GND on Bottom Layer: 0,70.13 75,70.13 75,-0.05 0,-0.05
GND on Bottom Layer: 0,68.42 74.84,68.42 74.84,0.97 0,0.97

## Text on the board
Bottom Silkscreen Layer: GP29 | GP25 | GP24 | GP23 | GND | GP8=KBDCLK / GP9=KBDDATA / GP14=RTCSDA / GP15=RTCSCL / GP16=HSYNC / GP17=VSYNC / GP18=BLUE / GP11=SDMOSI / GP12=SDMISO / GP13=SDCS / GP22=AUDIOL / GP23=AUDIOR / GP10=SDCLK | Configuration: / OPTION SYSTEM I2C GP14,GP15 / OPTION SDCARD GP13, GP10, GP11, GP12 / OPTION KEYBOARD UK/US/BE/ES/FR/GR/IT / OPTION RTC AUTO (optional) / OPTION AUDIO GP22, GP23 | GP0 / GP1 / GND / GP2 / GP3 / GP4 / GP5 / GND / GP6 / GP7 / GP8 / GP9 / GND / GP10 / GP11 / GP12 / GP13 / GND / GP14 / GP15 | VUSB / VUSB / GND / N/C / 3V3 / 3V3 / GP28 / GND / GP27 / GP26 / RUN / GP22 / GND / GP21 / GP20 / GP19 / GP18 / GND / GP17 / GP16
Top Silkscreen Layer: PicoMiteVGA V1.0a / PCB Peter Mather / MMBasic Geoff Graham & / Peter Mather | BOOT | GP0 | RESET
